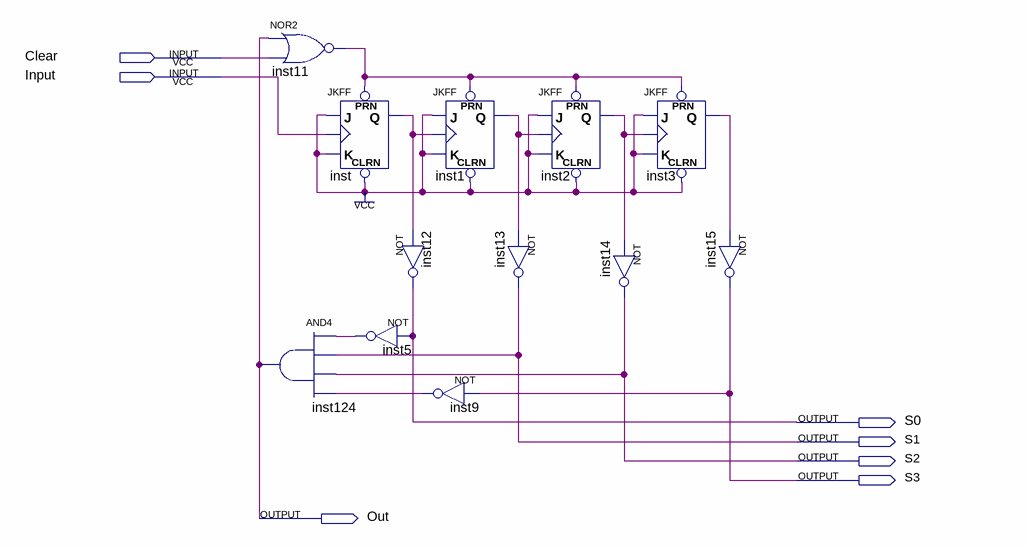
[diagram p0: schematic sheet]
// Quartus schematic Cont6.bdf as structural Verilog: 12 symbols, 7 pins
module Cont6 (
  input  Clear,
  input  Input,
  output S0,
  output S1,
  output S2,
  output S3,
  output Out
);

  wire inst1_q, inst2_q, inst3_q, inst5_out, inst9_out, inst11_out, inst_q;

  nor inst11 (inst11_out, Out, Clear);
  and inst124 (Out, inst5_out, S1, S2, inst9_out);
  JKFF inst (.PRN(inst11_out), .CLRN(1'b1), .K(1'b1), .J(1'b1), .CLK(Input), .Q(inst_q));
  not inst12 (S0, inst_q);
  not inst5 (inst5_out, S0);
  JKFF inst1 (.PRN(inst11_out), .CLRN(1'b1), .K(1'b1), .J(1'b1), .CLK(inst_q), .Q(inst1_q));
  not inst9 (inst9_out, S3);
  JKFF inst2 (.PRN(inst11_out), .CLRN(1'b1), .K(1'b1), .J(1'b1), .CLK(inst1_q), .Q(inst2_q));
  not inst13 (S1, inst1_q);
  not inst14 (S2, inst2_q);
  JKFF inst3 (.PRN(inst11_out), .CLRN(1'b1), .K(1'b1), .J(1'b1), .CLK(inst2_q), .Q(inst3_q));
  not inst15 (S3, inst3_q);
endmodule
